# Altium schematic sheet Sheet1.SchDoc
size 840 x 594 mm
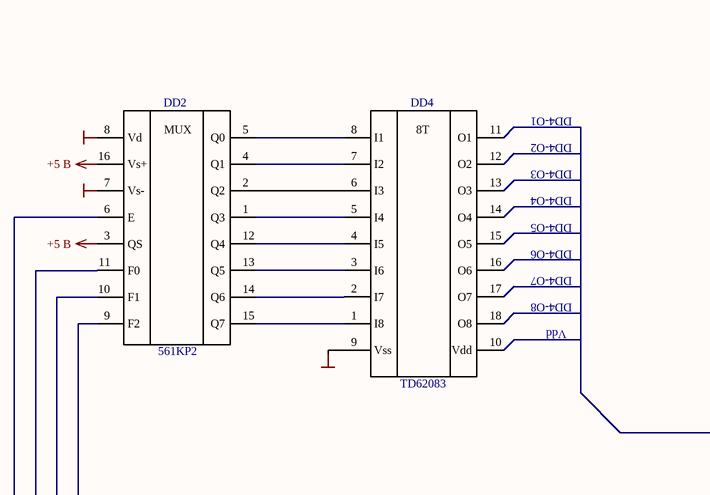
[diagram p0: Sheet1.SchDoc, top left]
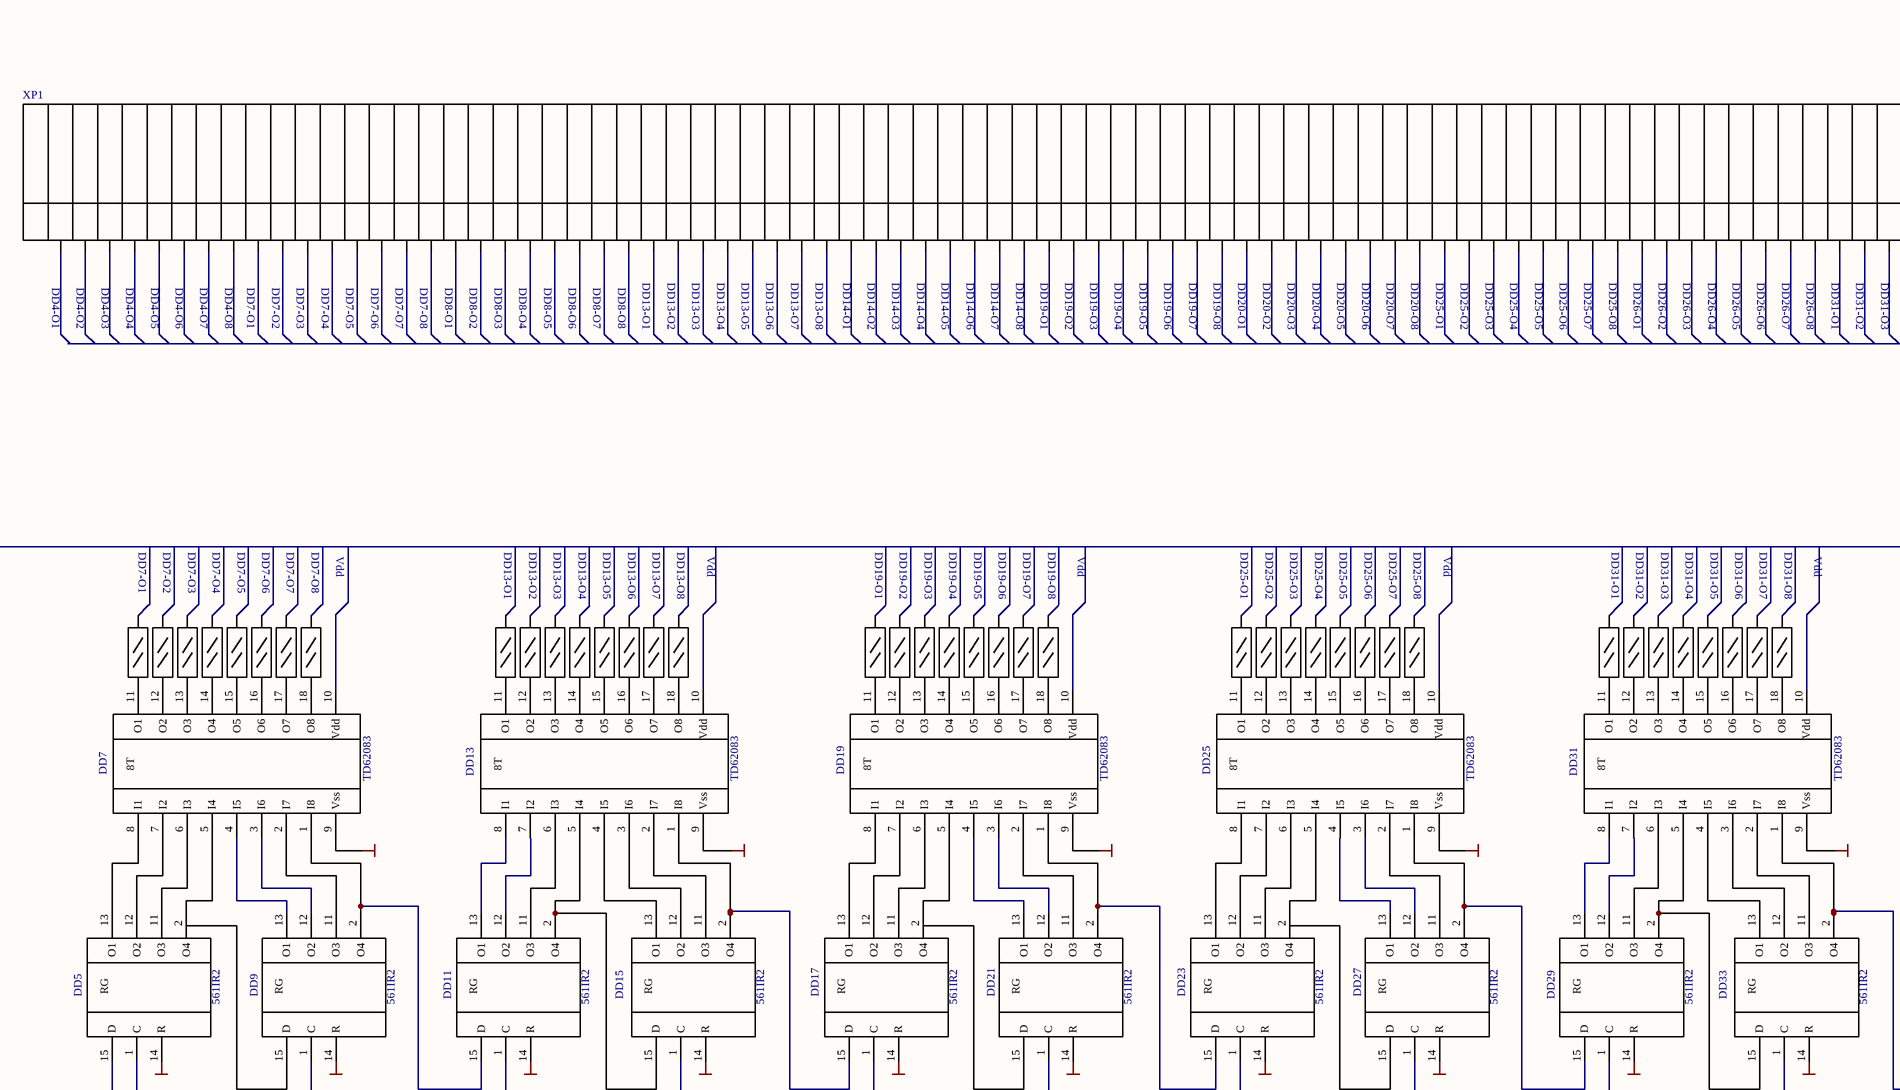
[diagram p1: Sheet1.SchDoc, top middle]
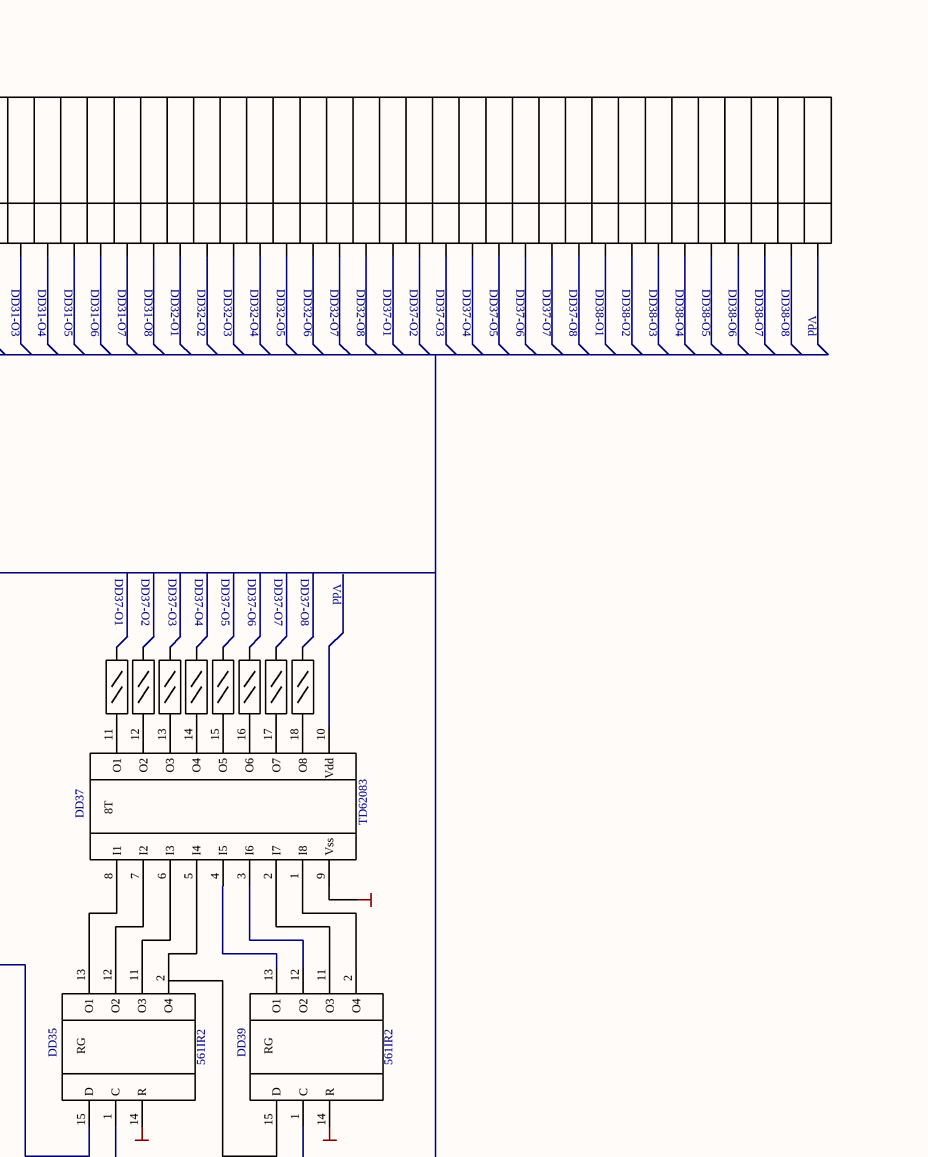
[diagram p2: Sheet1.SchDoc, top right]
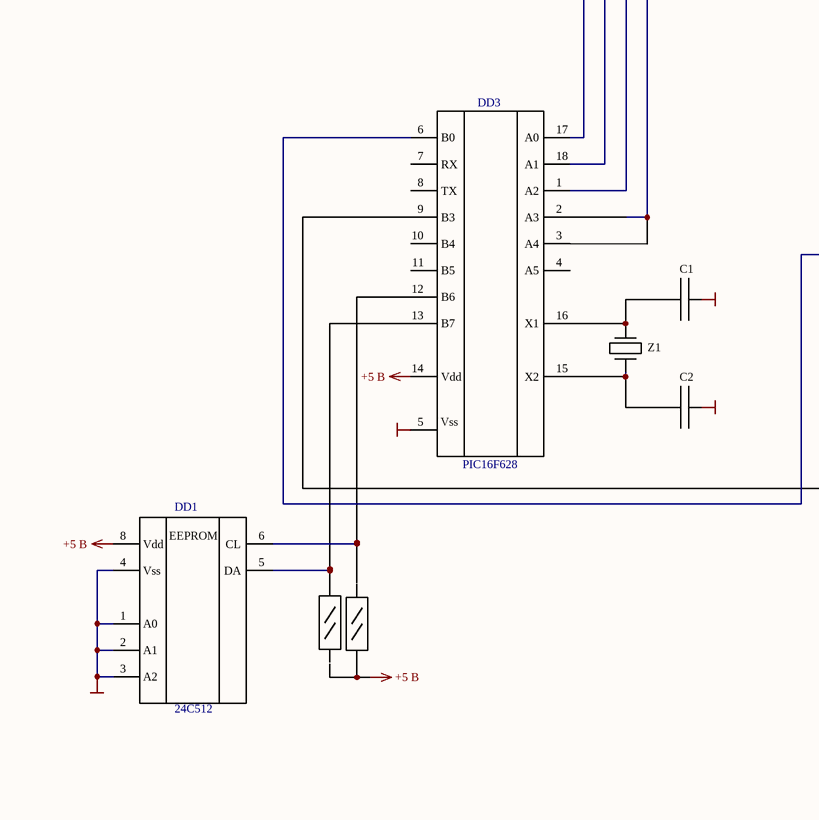
[diagram p3: Sheet1.SchDoc, bottom left]
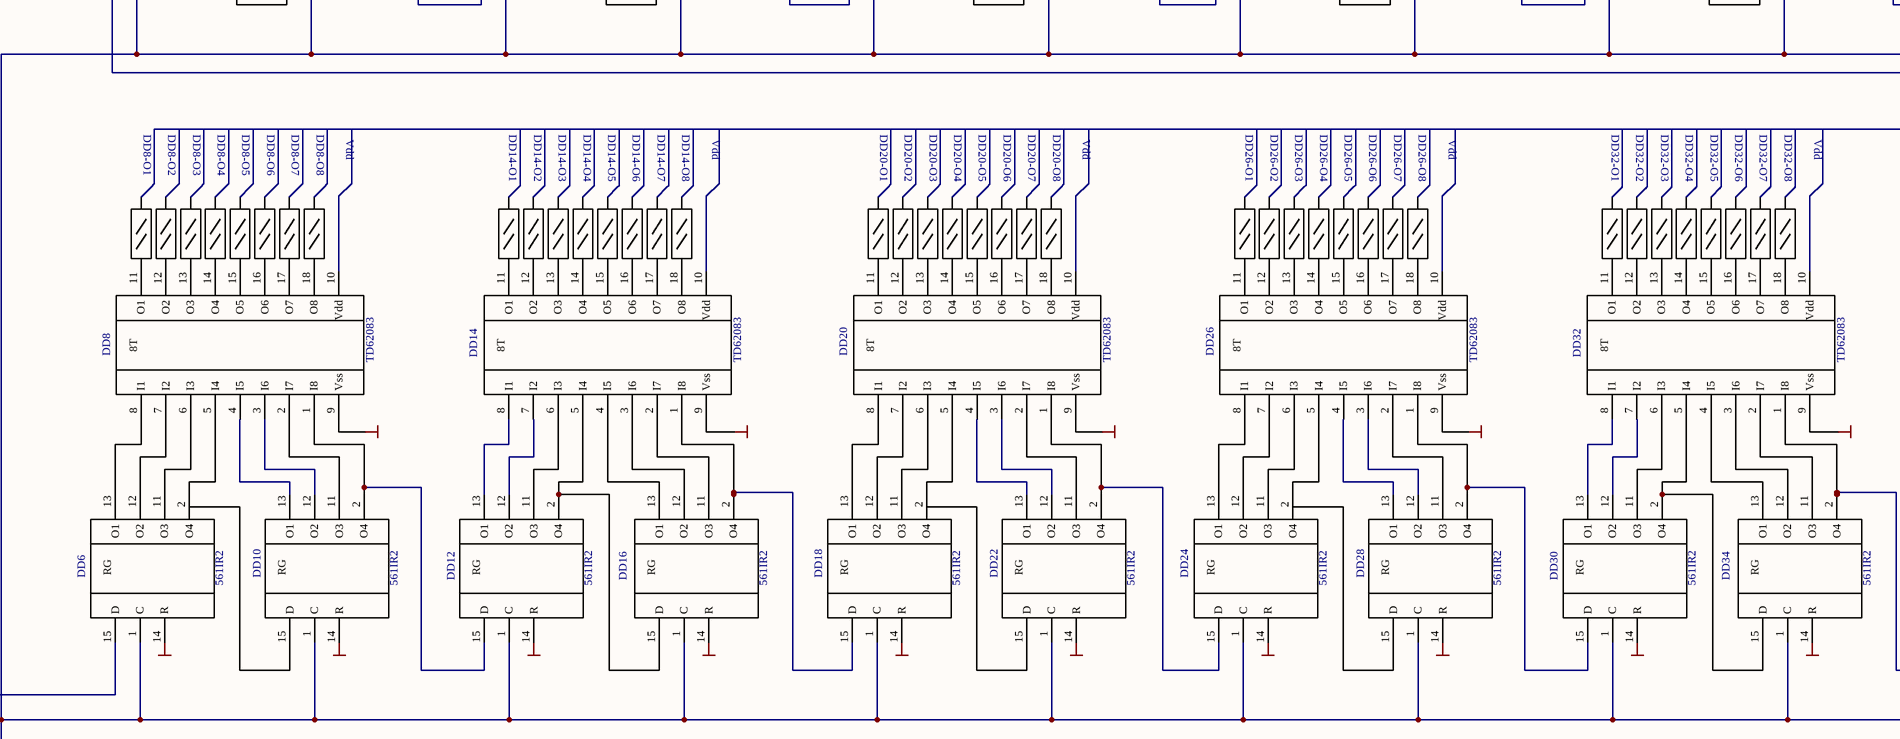
[diagram p4: Sheet1.SchDoc, bottom middle]
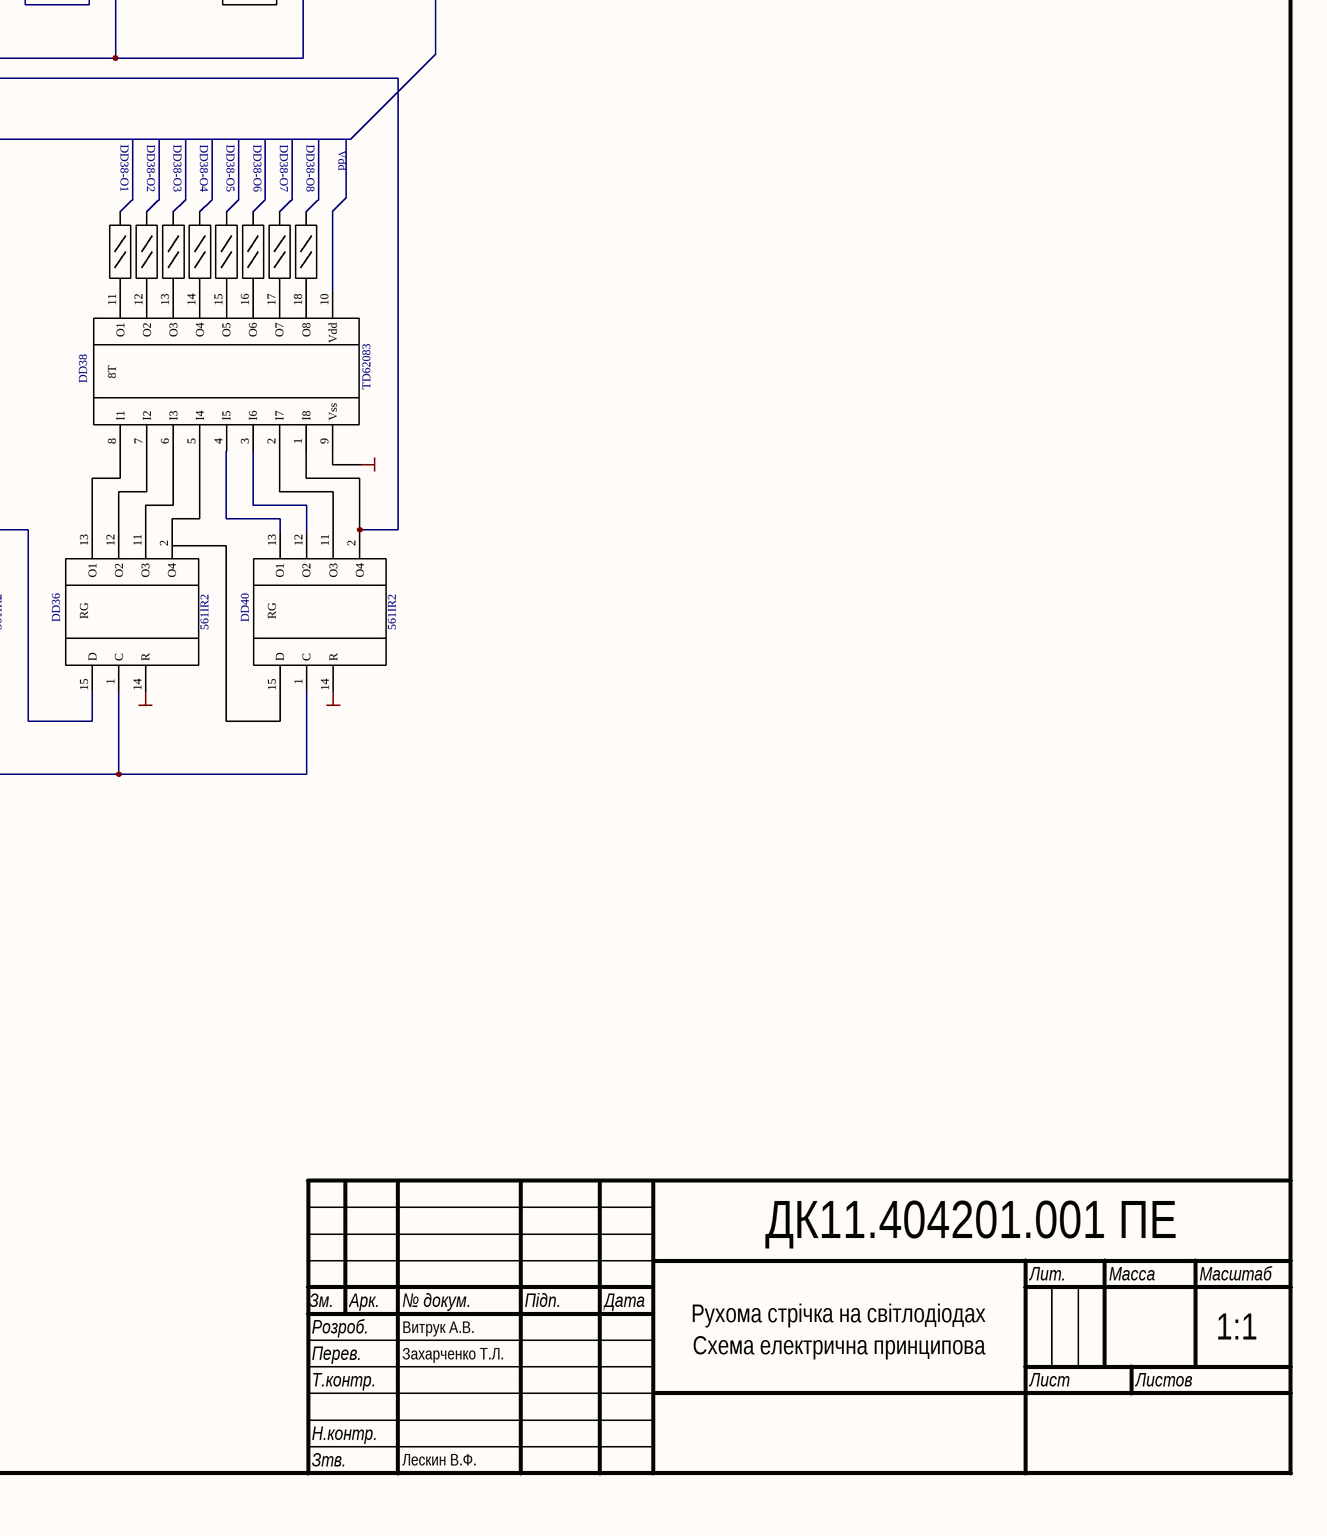
[diagram p5: Sheet1.SchDoc, bottom right]

## Parts
DD1  24C512  [24C512]
DD2  561KP2  [561KP2]
DD3  PIC16F628  [PIC16F628]
DD4  TD62083  [TD62083]
DD5  561IR2  [CD4015]
DD6  561IR2  [CD4015]
DD7  TD62083  [TD62083]
DD8  TD62083  [TD62083]
DD9  561IR2  [CD4015]
DD10  561IR2  [CD4015]
DD11  561IR2  [CD4015]
DD12  561IR2  [CD4015]
DD13  TD62083  [TD62083]
DD14  TD62083  [TD62083]
DD15  561IR2  [CD4015]
DD16  561IR2  [CD4015]
DD17  561IR2  [CD4015]
DD18  561IR2  [CD4015]
DD19  TD62083  [TD62083]
DD20  TD62083  [TD62083]
DD21  561IR2  [CD4015]
DD22  561IR2  [CD4015]
DD23  561IR2  [CD4015]
DD24  561IR2  [CD4015]
DD25  TD62083  [TD62083]
DD26  TD62083  [TD62083]
DD27  561IR2  [CD4015]
DD28  561IR2  [CD4015]
DD29  561IR2  [CD4015]
DD30  561IR2  [CD4015]
DD31  TD62083  [TD62083]
DD32  TD62083  [TD62083]
DD33  561IR2  [CD4015]
DD34  561IR2  [CD4015]
DD35  561IR2  [CD4015]
DD36  561IR2  [CD4015]
DD37  TD62083  [TD62083]
DD38  TD62083  [TD62083]
DD39  561IR2  [CD4015]
DD40  561IR2  [CD4015]
R1  Resistor125  [R_0805]  (value not drawn)
R2  Resistor125  [R_0805]  (value not drawn)
R3  Resistor125  [R_0805]  (value not drawn)
R4  Resistor125  [R_0805]  (value not drawn)
R5  Resistor125  [R_0805]  (value not drawn)
R6  Resistor125  [R_0805]  (value not drawn)
R7  Resistor125  [R_0805]  (value not drawn)
R8  Resistor125  [R_0805]  (value not drawn)
R9  Resistor125  [R_0805]  (value not drawn)
R10  Resistor125  [R_0805]  (value not drawn)
R11  Resistor125  [R_0805]  (value not drawn)
R12  Resistor125  [R_0805]  (value not drawn)
R13  Resistor125  [R_0805]  (value not drawn)
R14  Resistor125  [R_0805]  (value not drawn)
R15  Resistor125  [R_0805]  (value not drawn)
R16  Resistor125  [R_0805]  (value not drawn)
R17  Resistor125  [R_0805]  (value not drawn)
R18  Resistor125  [R_0805]  (value not drawn)
R19  Resistor125  [R_0805]  (value not drawn)
R20  Resistor125  [R_0805]  (value not drawn)
R21  Resistor125  [R_0805]  (value not drawn)
R22  Resistor125  [R_0805]  (value not drawn)
R23  Resistor125  [R_0805]  (value not drawn)
R24  Resistor125  [R_0805]  (value not drawn)
R25  Resistor125  [R_0805]  (value not drawn)
R26  Resistor125  [R_0805]  (value not drawn)
R27  Resistor125  [R_0805]  (value not drawn)
R28  Resistor125  [R_0805]  (value not drawn)
R29  Resistor125  [R_0805]  (value not drawn)
R30  Resistor125  [R_0805]  (value not drawn)
R31  Resistor125  [R_0805]  (value not drawn)
R32  Resistor125  [R_0805]  (value not drawn)
R33  Resistor125  [R_0805]  (value not drawn)
R34  Resistor125  [R_0805]  (value not drawn)
R35  Resistor125  [R_0805]  (value not drawn)
R36  Resistor125  [R_0805]  (value not drawn)
R37  Resistor125  [R_0805]  (value not drawn)
R38  Resistor125  [R_0805]  (value not drawn)
R39  Resistor125  [R_0805]  (value not drawn)
R40  Resistor125  [R_0805]  (value not drawn)
R41  Resistor125  [R_0805]  (value not drawn)
R42  Resistor125  [R_0805]  (value not drawn)
R43  Resistor125  [R_0805]  (value not drawn)
R44  Resistor125  [R_0805]  (value not drawn)
R45  Resistor125  [R_0805]  (value not drawn)
R46  Resistor125  [R_0805]  (value not drawn)
R47  Resistor125  [R_0805]  (value not drawn)
R48  Resistor125  [R_0805]  (value not drawn)
R49  Resistor125  [R_0805]  (value not drawn)
R50  Resistor125  [R_0805]  (value not drawn)
R51  Resistor125  [R_0805]  (value not drawn)
R52  Resistor125  [R_0805]  (value not drawn)
R53  Resistor125  [R_0805]  (value not drawn)
R54  Resistor125  [R_0805]  (value not drawn)
R55  Resistor125  [R_0805]  (value not drawn)
R56  Resistor125  [R_0805]  (value not drawn)
R57  Resistor125  [R_0805]  (value not drawn)
R58  Resistor125  [R_0805]  (value not drawn)
R59  Resistor125  [R_0805]  (value not drawn)
R60  Resistor125  [R_0805]  (value not drawn)
R61  Resistor125  [R_0805]  (value not drawn)
R62  Resistor125  [R_0805]  (value not drawn)
R63  Resistor125  [R_0805]  (value not drawn)
R64  Resistor125  [R_0805]  (value not drawn)
R65  Resistor125  [R_0805]  (value not drawn)
R66  Resistor125  [R_0805]  (value not drawn)
R67  Resistor125  [R_0805]  (value not drawn)
R68  Resistor125  [R_0805]  (value not drawn)
R69  Resistor125  [R_0805]  (value not drawn)
R70  Resistor125  [R_0805]  (value not drawn)
R71  Resistor125  [R_0805]  (value not drawn)
R72  Resistor125  [R_0805]  (value not drawn)
R73  Resistor125  [R_0805]  (value not drawn)
R74  Resistor125  [R_0805]  (value not drawn)
R75  Resistor125  [R_0805]  (value not drawn)
R76  Resistor125  [R_0805]  (value not drawn)
R77  Resistor125  [R_0805]  (value not drawn)
R78  Resistor125  [R_0805]  (value not drawn)
R79  Resistor125  [R_0805]  (value not drawn)
R80  Resistor125  [R_0805]  (value not drawn)
R81  Resistor125  [R_0805]  (value not drawn)
R82  Resistor125  [R_0805]  (value not drawn)
R83  Resistor125  [R_0805]  (value not drawn)
R84  Resistor125  [R_0805]  (value not drawn)
R85  Resistor125  [R_0805]  (value not drawn)
R86  Resistor125  [R_0805]  (value not drawn)
R87  Resistor125  [R_0805]  (value not drawn)
R88  Resistor125  [R_0805]  (value not drawn)
R89  Resistor125  [R_0805]  (value not drawn)
R90  Resistor125  [R_0805]  (value not drawn)
R91  Resistor125  [R_0805]  (value not drawn)
R92  Resistor125  [R_0805]  (value not drawn)
R93  Resistor125  [R_0805]  (value not drawn)
R94  Resistor125  [R_0805]  (value not drawn)
R95  Resistor125  [R_0805]  (value not drawn)
R96  Resistor125  [R_0805]  (value not drawn)
R97  Resistor125  [R_0805]  (value not drawn)
R98  Resistor125  [R_0805]  (value not drawn)
XP1  Contact  [Connector]  (value not drawn)
Z1  Resonator  [Z_SMD]  (value not drawn)
С1  Capacitor  [C_0805]  (value not drawn)
С2  Capacitor  [C_0805]  (value not drawn)

## Nets
+5 В: DD1.8(Vdd) DD2.3(QS) DD2.16(Vs+) DD3.14(Vdd) R2.1
GND: DD1.1(A0) DD1.2(A1) DD1.3(A2) DD1.4(Vss) DD2.7(Vs-) DD2.8(Vd) DD3.5 DD4.9(Vss) DD5.14(R) DD6.14(R) DD7.9(Vss) DD8.9(Vss) DD9.14(R) DD10.14(R) DD11.14(R) DD12.14(R) DD13.9(Vss) DD14.9(Vss) DD15.14(R) DD16.14(R) DD17.14(R) DD18.14(R) DD19.9(Vss) DD20.9(Vss) DD21.14(R) DD22.14(R) DD23.14(R) DD24.14(R) DD25.9(Vss) DD26.9(Vss) DD27.14(R) DD28.14(R) DD29.14(R) DD30.14(R) DD31.9(Vss) DD32.9(Vss) DD33.14(R) DD34.14(R) DD35.14(R) DD36.14(R) DD37.9(Vss) DD38.9(Vss) DD39.14(R) DD40.14(R) С1.3 С2.3
NetDD1_5: DD1.5(DA) DD3.13(B7) R1.2
NetDD1_6: DD1.6(CL) DD3.12(B6)
NetDD2_1: DD2.1(Q3) DD4.5(I4)
NetDD2_2: DD2.2(Q2) DD4.6(I3)
NetDD2_4: DD2.4(Q1) DD4.7(I2)
NetDD2_5: DD2.5(Q0) DD4.8(I1)
NetDD2_6: DD2.6(E) DD3.2(A3) DD3.3(A4)
NetDD2_9: DD2.9(F2) DD3.18(A1)
NetDD2_10: DD2.10(F1) DD3.17(A0)
NetDD2_11: DD2.11(F0) DD3.1(A2)
NetDD2_12: DD2.12(Q4) DD4.4(I5)
NetDD2_13: DD2.13(Q5) DD4.3(I6)
NetDD2_14: DD2.14(Q6) DD4.2(I7)
NetDD2_15: DD2.15(Q7) DD4.1(I8)
NetDD3_6: DD3.6(B0) DD6.15(D)
NetDD3_9: DD3.9(B3) DD5.1(C) DD6.1(C) DD9.1(C) DD10.1(C) DD11.1(C) DD12.1(C) DD15.1(C) DD16.1(C) DD17.1(C) DD18.1(C) DD21.1(C) DD22.1(C) DD23.1(C) DD24.1(C) DD27.1(C) DD28.1(C) DD29.1(C) DD30.1(C) DD33.1(C) DD34.1(C) DD35.1(C) DD36.1(C) DD39.1(C) DD40.1(C)
NetDD3_15: DD3.15(X2) Z1.10 С2.4
NetDD3_16: DD3.16(X1) Z1.11 С1.4
NetDD5_2: DD5.2(O4) DD7.5(I4)
NetDD5_11: DD5.11(O3) DD7.6(I3)
NetDD5_12: DD5.12(O2) DD7.7(I2)
NetDD5_13: DD5.13(O1) DD7.8(I1)
NetDD5_15: DD5.15(D) DD38.1(I8) DD40.2(O4)
NetDD6_2: DD6.2(O4) DD8.5(I4)
NetDD6_11: DD6.11(O3) DD8.6(I3)
NetDD6_12: DD6.12(O2) DD8.7(I2)
NetDD6_13: DD6.13(O1) DD8.8(I1)
NetDD7_1: DD7.1(I8) DD9.2(O4) DD11.15(D)
NetDD7_2: DD7.2(I7) DD9.11(O3)
NetDD7_3: DD7.3(I6) DD9.12(O2)
NetDD7_4: DD7.4(I5) DD9.13(O1)
NetDD7_11: DD7.11(O1) R3.1
NetDD7_12: DD7.12(O2) R5.1
NetDD7_13: DD7.13(O3) R7.1
NetDD7_14: DD7.14(O4) R9.1
NetDD7_15: DD7.15(O5) R11.1
NetDD7_16: DD7.16(O6) R13.1
NetDD7_17: DD7.17(O7) R15.1
NetDD7_18: DD7.18(O8) R17.1
NetDD8_1: DD8.1(I8) DD10.2(O4) DD12.15(D)
NetDD8_2: DD8.2(I7) DD10.11(O3)
NetDD8_3: DD8.3(I6) DD10.12(O2)
NetDD8_4: DD8.4(I5) DD10.13(O1)
NetDD8_11: DD8.11(O1) R4.1
NetDD8_12: DD8.12(O2) R6.1
NetDD8_13: DD8.13(O3) R8.1
NetDD8_14: DD8.14(O4) R10.1
NetDD8_15: DD8.15(O5) R12.1
NetDD8_16: DD8.16(O6) R14.1
NetDD8_17: DD8.17(O7) R16.1
NetDD8_18: DD8.18(O8) R18.1
NetDD11_2: DD11.2(O4) DD13.5(I4) DD15.15(D)
NetDD11_11: DD11.11(O3) DD13.6(I3)
NetDD11_12: DD11.12(O2) DD13.7(I2)
NetDD11_13: DD11.13(O1) DD13.8(I1)
NetDD12_2: DD12.2(O4) DD14.5(I4) DD16.15(D)
NetDD12_11: DD12.11(O3) DD14.6(I3)
NetDD12_12: DD12.12(O2) DD14.7(I2)
NetDD12_13: DD12.13(O1) DD14.8(I1)
NetDD13_1: DD13.1(I8) DD15.2(O4) DD17.15(D)
NetDD13_2: DD13.2(I7) DD15.11(O3)
NetDD13_3: DD13.3(I6) DD15.12(O2)
NetDD13_4: DD13.4(I5) DD15.13(O1)
NetDD13_11: DD13.11(O1) R19.1
NetDD13_12: DD13.12(O2) R21.1
NetDD13_13: DD13.13(O3) R23.1
NetDD13_14: DD13.14(O4) R25.1
NetDD13_15: DD13.15(O5) R27.1
NetDD13_16: DD13.16(O6) R29.1
NetDD13_17: DD13.17(O7) R31.1
NetDD13_18: DD13.18(O8) R33.1
NetDD14_1: DD14.1(I8) DD16.2(O4) DD18.15(D)
NetDD14_2: DD14.2(I7) DD16.11(O3)
NetDD14_3: DD14.3(I6) DD16.12(O2)
NetDD14_4: DD14.4(I5) DD16.13(O1)
NetDD14_11: DD14.11(O1) R20.1
NetDD14_12: DD14.12(O2) R22.1
NetDD14_13: DD14.13(O3) R24.1
NetDD14_14: DD14.14(O4) R26.1
NetDD14_15: DD14.15(O5) R28.1
NetDD14_16: DD14.16(O6) R30.1
NetDD14_17: DD14.17(O7) R32.1
NetDD14_18: DD14.18(O8) R34.1
NetDD17_2: DD17.2(O4) DD19.5(I4)
NetDD17_11: DD17.11(O3) DD19.6(I3)
NetDD17_12: DD17.12(O2) DD19.7(I2)
NetDD17_13: DD17.13(O1) DD19.8(I1)
NetDD18_2: DD18.2(O4) DD20.5(I4)
NetDD18_11: DD18.11(O3) DD20.6(I3)
NetDD18_12: DD18.12(O2) DD20.7(I2)
NetDD18_13: DD18.13(O1) DD20.8(I1)
NetDD19_1: DD19.1(I8) DD21.2(O4) DD23.15(D)
NetDD19_2: DD19.2(I7) DD21.11(O3)
NetDD19_3: DD19.3(I6) DD21.12(O2)
NetDD19_4: DD19.4(I5) DD21.13(O1)
NetDD19_11: DD19.11(O1) R35.1
NetDD19_12: DD19.12(O2) R37.1
NetDD19_13: DD19.13(O3) R39.1
NetDD19_14: DD19.14(O4) R41.1
NetDD19_15: DD19.15(O5) R43.1
NetDD19_16: DD19.16(O6) R45.1
NetDD19_17: DD19.17(O7) R47.1
NetDD19_18: DD19.18(O8) R49.1
NetDD20_1: DD20.1(I8) DD22.2(O4) DD24.15(D)
NetDD20_2: DD20.2(I7) DD22.11(O3)
NetDD20_3: DD20.3(I6) DD22.12(O2)
NetDD20_4: DD20.4(I5) DD22.13(O1)
NetDD20_11: DD20.11(O1) R36.1
NetDD20_12: DD20.12(O2) R38.1
NetDD20_13: DD20.13(O3) R40.1
NetDD20_14: DD20.14(O4) R42.1
NetDD20_15: DD20.15(O5) R44.1
NetDD20_16: DD20.16(O6) R46.1
NetDD20_17: DD20.17(O7) R48.1
NetDD20_18: DD20.18(O8) R50.1
NetDD23_2: DD23.2(O4) DD25.5(I4)
NetDD23_11: DD23.11(O3) DD25.6(I3)
NetDD23_12: DD23.12(O2) DD25.7(I2)
NetDD23_13: DD23.13(O1) DD25.8(I1)
NetDD24_2: DD24.2(O4) DD26.5(I4)
NetDD24_11: DD24.11(O3) DD26.6(I3)
NetDD24_12: DD24.12(O2) DD26.7(I2)
NetDD24_13: DD24.13(O1) DD26.8(I1)
NetDD25_1: DD25.1(I8) DD27.2(O4) DD29.15(D)
NetDD25_2: DD25.2(I7) DD27.11(O3)
NetDD25_3: DD25.3(I6) DD27.12(O2)
NetDD25_4: DD25.4(I5) DD27.13(O1)
NetDD25_11: DD25.11(O1) R51.1
NetDD25_12: DD25.12(O2) R53.1
NetDD25_13: DD25.13(O3) R55.1
NetDD25_14: DD25.14(O4) R57.1
NetDD25_15: DD25.15(O5) R59.1
NetDD25_16: DD25.16(O6) R61.1
NetDD25_17: DD25.17(O7) R63.1
NetDD25_18: DD25.18(O8) R65.1
NetDD26_1: DD26.1(I8) DD28.2(O4) DD30.15(D)
NetDD26_2: DD26.2(I7) DD28.11(O3)
NetDD26_3: DD26.3(I6) DD28.12(O2)
NetDD26_4: DD26.4(I5) DD28.13(O1)
NetDD26_11: DD26.11(O1) R52.1
NetDD26_12: DD26.12(O2) R54.1
NetDD26_13: DD26.13(O3) R56.1
NetDD26_14: DD26.14(O4) R58.1
NetDD26_15: DD26.15(O5) R60.1
NetDD26_16: DD26.16(O6) R62.1
NetDD26_17: DD26.17(O7) R64.1
NetDD26_18: DD26.18(O8) R66.1
NetDD29_2: DD29.2(O4) DD31.5(I4) DD33.15(D)
NetDD29_11: DD29.11(O3) DD31.6(I3)
NetDD29_12: DD29.12(O2) DD31.7(I2)
NetDD29_13: DD29.13(O1) DD31.8(I1)
NetDD30_2: DD30.2(O4) DD32.5(I4) DD34.15(D)
NetDD30_11: DD30.11(O3) DD32.6(I3)
NetDD30_12: DD30.12(O2) DD32.7(I2)
NetDD30_13: DD30.13(O1) DD32.8(I1)
NetDD31_1: DD31.1(I8) DD33.2(O4) DD35.15(D)
NetDD31_2: DD31.2(I7) DD33.11(O3)
NetDD31_3: DD31.3(I6) DD33.12(O2)
NetDD31_4: DD31.4(I5) DD33.13(O1)
NetDD31_11: DD31.11(O1) R67.1
NetDD31_12: DD31.12(O2) R69.1
NetDD31_13: DD31.13(O3) R71.1
NetDD31_14: DD31.14(O4) R73.1
NetDD31_15: DD31.15(O5) R75.1
NetDD31_16: DD31.16(O6) R77.1
NetDD31_17: DD31.17(O7) R79.1
NetDD31_18: DD31.18(O8) R81.1
NetDD32_1: DD32.1(I8) DD34.2(O4) DD36.15(D)
NetDD32_2: DD32.2(I7) DD34.11(O3)
NetDD32_3: DD32.3(I6) DD34.12(O2)
NetDD32_4: DD32.4(I5) DD34.13(O1)
NetDD32_11: DD32.11(O1) R68.1
NetDD32_12: DD32.12(O2) R70.1
NetDD32_13: DD32.13(O3) R72.1
NetDD32_14: DD32.14(O4) R74.1
NetDD32_15: DD32.15(O5) R76.1
NetDD32_16: DD32.16(O6) R78.1
NetDD32_17: DD32.17(O7) R80.1
NetDD32_18: DD32.18(O8) R82.1
NetDD35_2: DD35.2(O4) DD37.5(I4)
NetDD35_11: DD35.11(O3) DD37.6(I3)
NetDD35_12: DD35.12(O2) DD37.7(I2)
NetDD35_13: DD35.13(O1) DD37.8(I1)
NetDD36_2: DD36.2(O4) DD38.5(I4)
NetDD36_11: DD36.11(O3) DD38.6(I3)
NetDD36_12: DD36.12(O2) DD38.7(I2)
NetDD36_13: DD36.13(O1) DD38.8(I1)
NetDD37_1: DD37.1(I8) DD39.2(O4)
NetDD37_2: DD37.2(I7) DD39.11(O3)
NetDD37_3: DD37.3(I6) DD39.12(O2)
NetDD37_4: DD37.4(I5) DD39.13(O1)
NetDD37_11: DD37.11(O1) R83.1
NetDD37_12: DD37.12(O2) R85.1
NetDD37_13: DD37.13(O3) R87.1
NetDD37_14: DD37.14(O4) R89.1
NetDD37_15: DD37.15(O5) R91.1
NetDD37_16: DD37.16(O6) R93.1
NetDD37_17: DD37.17(O7) R95.1
NetDD37_18: DD37.18(O8) R97.1
NetDD38_2: DD38.2(I7) DD40.11(O3)
NetDD38_3: DD38.3(I6) DD40.12(O2)
NetDD38_4: DD38.4(I5) DD40.13(O1)
NetDD38_11: DD38.11(O1) R84.1
NetDD38_12: DD38.12(O2) R86.1
NetDD38_13: DD38.13(O3) R88.1
NetDD38_14: DD38.14(O4) R90.1
NetDD38_15: DD38.15(O5) R92.1
NetDD38_16: DD38.16(O6) R94.1
NetDD38_17: DD38.17(O7) R96.1
NetDD38_18: DD38.18(O8) R98.1

Not connected (* = marked no-connect by the designer): DD3 4(A5) 7(RX) 8(TX) 10(B4) 11(B5); DD4 10(Vdd) 11(O1) 12(O2) 13(O3) 14(O4) 15(O5) 16(O6) 17(O7) 18(O8); DD7 10(Vdd); DD8 10(Vdd); DD9 15(D); DD10 15(D); DD13 10(Vdd); DD14 10(Vdd); DD19 10(Vdd); DD20 10(Vdd); DD21 15(D); DD22 15(D); DD25 10(Vdd); DD26 10(Vdd); DD27 15(D); DD28 15(D); DD31 10(Vdd); DD32 10(Vdd); DD37 10(Vdd); DD38 10(Vdd); DD39 15(D); DD40 15(D); R1 1; R2 2; R3 2; R4 2; R5 2; R6 2; R7 2; R8 2; R9 2; R10 2; R11 2; R12 2; R13 2; R14 2; R15 2; R16 2; R17 2; R18 2; R19 2; R20 2; R21 2; R22 2; R23 2; R24 2; R25 2; R26 2; R27 2; R28 2; R29 2; R30 2; R31 2; R32 2; R33 2; R34 2; R35 2; R36 2; R37 2; R38 2; R39 2; R40 2; R41 2; R42 2; R43 2; R44 2; R45 2; R46 2; R47 2; R48 2; R49 2; R50 2; R51 2; R52 2; R53 2; R54 2; R55 2; R56 2; R57 2; R58 2; R59 2; R60 2; R61 2; R62 2; R63 2; R64 2; R65 2; R66 2; R67 2; R68 2; R69 2; R70 2; R71 2; R72 2; R73 2; R74 2; R75 2; R76 2; R77 2; R78 2; R79 2; R80 2; R81 2; R82 2; R83 2; R84 2; R85 2; R86 2; R87 2; R88 2; R89 2; R90 2; R91 2; R92 2; R93 2; R94 2; R95 2; R96 2; R97 2; R98 2; XP1 1 2 3 4 5 6 7 8 9 10 11 12 13 14 15 16 17 18 19 20 21 22 23 24 25 26 27 28 29 30 31 32 33 34 35 36 37 38 39 40 41 42 43 44 45 46 47 48 49 50 51 52 53 54 55 56 57 58 59 60 61 62 63 64 65 66 67 68 69 70 71 72 73 74 75 76 77 78 79 80 81 82 83 84 85 86 87 88 89 90 91 92 93 94 95 96 97 98 99 100 101 102 103 104 105

## Notes on the sheet
- DD4-O1
- DD4-O2
- DD4-O3
- (near XP1) DD4-O1
- (near XP1) DD4-O2
- (near XP1) DD4-O3
- (near XP1) DD4-O4
- (near XP1) DD4-O5
- (near XP1) DD4-O6
- (near XP1) DD4-O7
- (near XP1) DD4-O8
- (near XP1) DD7-O1
- (near XP1) DD7-O2
- (near XP1) DD7-O3
- (near XP1) DD7-O4
- (near XP1) DD7-O5
- (near XP1) DD7-O6
- (near XP1) DD7-O7
- (near XP1) DD7-O8
- (near XP1) DD8-O1
- (near XP1) DD8-O2
- (near XP1) DD8-O3
- (near XP1) DD8-O4
- (near XP1) DD8-O5
- (near XP1) DD8-O6
- (near XP1) DD8-O7
- (near XP1) DD8-O8
- (near XP1) DD13-O1
- (near XP1) DD13-O2
- (near XP1) DD13-O3
- (near XP1) DD13-O4
- (near XP1) DD13-O5
- (near XP1) DD13-O6
- (near XP1) DD13-O7
- (near XP1) DD13-O8
- (near XP1) DD14-O1
- (near XP1) DD14-O2
- (near XP1) DD14-O3
- (near XP1) DD14-O4
- (near XP1) DD14-O5
- (near XP1) DD14-O6
- (near XP1) DD14-O7
- (near XP1) DD14-O8
- (near XP1) DD19-O1
- (near XP1) DD19-O2
- (near XP1) DD19-O3
- (near XP1) DD19-O4
- (near XP1) DD19-O5
- (near XP1) DD19-O6
- (near XP1) DD19-O7
- (near XP1) DD19-O8
- (near XP1) DD20-O1
- (near XP1) DD20-O2
- (near XP1) DD20-O3
- (near XP1) DD20-O4
- (near XP1) DD20-O5
- (near XP1) DD20-O6
- (near XP1) DD20-O7
- (near XP1) DD20-O8
- (near XP1) DD25-O1
- (near XP1) DD25-O2
- (near XP1) DD25-O3
- (near XP1) DD25-O4
- (near XP1) DD25-O5
- (near XP1) DD25-O6
- (near XP1) DD25-O7
- (near XP1) DD25-O8
- (near XP1) DD26-O1
- (near XP1) DD26-O2
- (near XP1) DD26-O3
- (near XP1) DD26-O4
- (near XP1) DD26-O5
- (near XP1) DD26-O6
- (near XP1) DD26-O7
- (near XP1) DD26-O8
- (near XP1) DD31-O1
- (near XP1) DD31-O2
- (near XP1) DD31-O3
- (near XP1) DD31-O4
- (near XP1) DD31-O5
- (near XP1) DD31-O6
- (near XP1) DD31-O7
- (near XP1) DD31-O8
- (near XP1) DD32-O1
- (near XP1) DD32-O2
- (near XP1) DD32-O3
- (near XP1) DD32-O4
- (near XP1) DD32-O5
- (near XP1) DD32-O6
- (near XP1) DD32-O7
- (near XP1) DD32-O8
- (near XP1) DD37-O1
- (near XP1) DD37-O2
- (near XP1) DD37-O3
- (near XP1) DD37-O4
- (near XP1) DD37-O5
- (near XP1) DD37-O6
- (near XP1) DD37-O7
- (near XP1) DD37-O8
- (near XP1) DD38-O1
- (near XP1) DD38-O2
- (near XP1) DD38-O3
- (near XP1) DD38-O4
- (near XP1) DD38-O5
- (near XP1) DD38-O6
- (near XP1) DD38-O7
- (near XP1) DD38-O8
- Vdd
- DD4-O4
- DD4-O5
- DD4-O6
- DD4-O7
- DD4-O8
- DD7-O1
- DD7-O2
- DD7-O3
- DD7-O4
- DD7-O5
- DD7-O6
- DD7-O7
- DD7-O8
- DD13-O1
- DD13-O2
- DD13-O3
- DD13-O4
- DD13-O5
- DD13-O6
- DD13-O7
- DD13-O8
- DD19-O1
- DD19-O2
- DD19-O3
- DD19-O4
- DD19-O5
- DD19-O6
- DD19-O7
- DD19-O8
- DD25-O1
- DD25-O2
- DD25-O3
- DD25-O4
- DD25-O5
- DD25-O6
- DD25-O7
- DD25-O8
- DD31-O1
- DD31-O2
- DD31-O3
- DD31-O4
- DD31-O5
- DD31-O6
- DD31-O7
- DD31-O8
- DD37-O1
- DD37-O2
- DD37-O3
- DD37-O4
- DD37-O5
- DD37-O6
- DD37-O7
- DD37-O8
- DD8-O1
- DD8-O2
- DD8-O3
- DD8-O4
- DD8-O5
- DD8-O6
- DD8-O7
- DD8-O8
- DD14-O1
- DD14-O2
- DD14-O3
- DD14-O4
- DD14-O5
- DD14-O6
- DD14-O7
- DD14-O8
- DD20-O1
- DD20-O2
- DD20-O3
- DD20-O4
- DD20-O5
- DD20-O6
- DD20-O7
- DD20-O8
- DD26-O1
- DD26-O2
- DD26-O3
- DD26-O4
- DD26-O5
- DD26-O6
- DD26-O7
- DD26-O8
- DD32-O1
- DD32-O2
- DD32-O3
- DD32-O4
- DD32-O5
- DD32-O6
- DD32-O7
- DD32-O8
- DD38-O1
- DD38-O2
- DD38-O3
- DD38-O4
- DD38-O5
- DD38-O6
- DD38-O7
- DD38-O8
- ДК11.404201.001 ПЕ
- Зм.
- Розроб.
- Арк.
- № докум.
- Витрук А.В.
- Підп.
- Дата
- Рухома стрічка на світлодіодах
- Лит.
- Масса
- Масштаб
- 1:1
- Перев.
- Т.контр.
- Захарченко Т.Л.
- Схема електрична принципова
- Лист
- Листов
- Зтв.
- Н.контр.
- Лескин В.Ф.
- (in symbol 24C512) EEPROM
- (in symbol 561IR2) RG
- (in symbol 561KP2) MUX
- (in symbol PIC16F628) Vss
- (in symbol TD62083) 8T

## Library data of the parts
DD1 = 24C512: EEPROM/24C512-SMD
DD2 = 561KP2: Мультиплексор/Аналог 4051М smd
DD3 = PIC16F628: Микроконтроллер
DD4 DD7 DD8 DD13 DD14 DD19 DD20 DD25 DD26 DD31 DD32 DD37 DD38 = TD62083: Darlington Sink Driver
DD5 DD6 DD9-DD12 DD15-DD18 DD21-DD24 DD27-DD30 DD33-DD36 DD39 DD40 = 561IR2: Регистр сдвига
R1-R98 = Resistor125: Резистор 0.125Вт
Z1 = Resonator: Резонатор/КХ-13
С1 С2 = Capacitor: Конденсатор